# Altium project Field Sensor Front end.PrjPcb
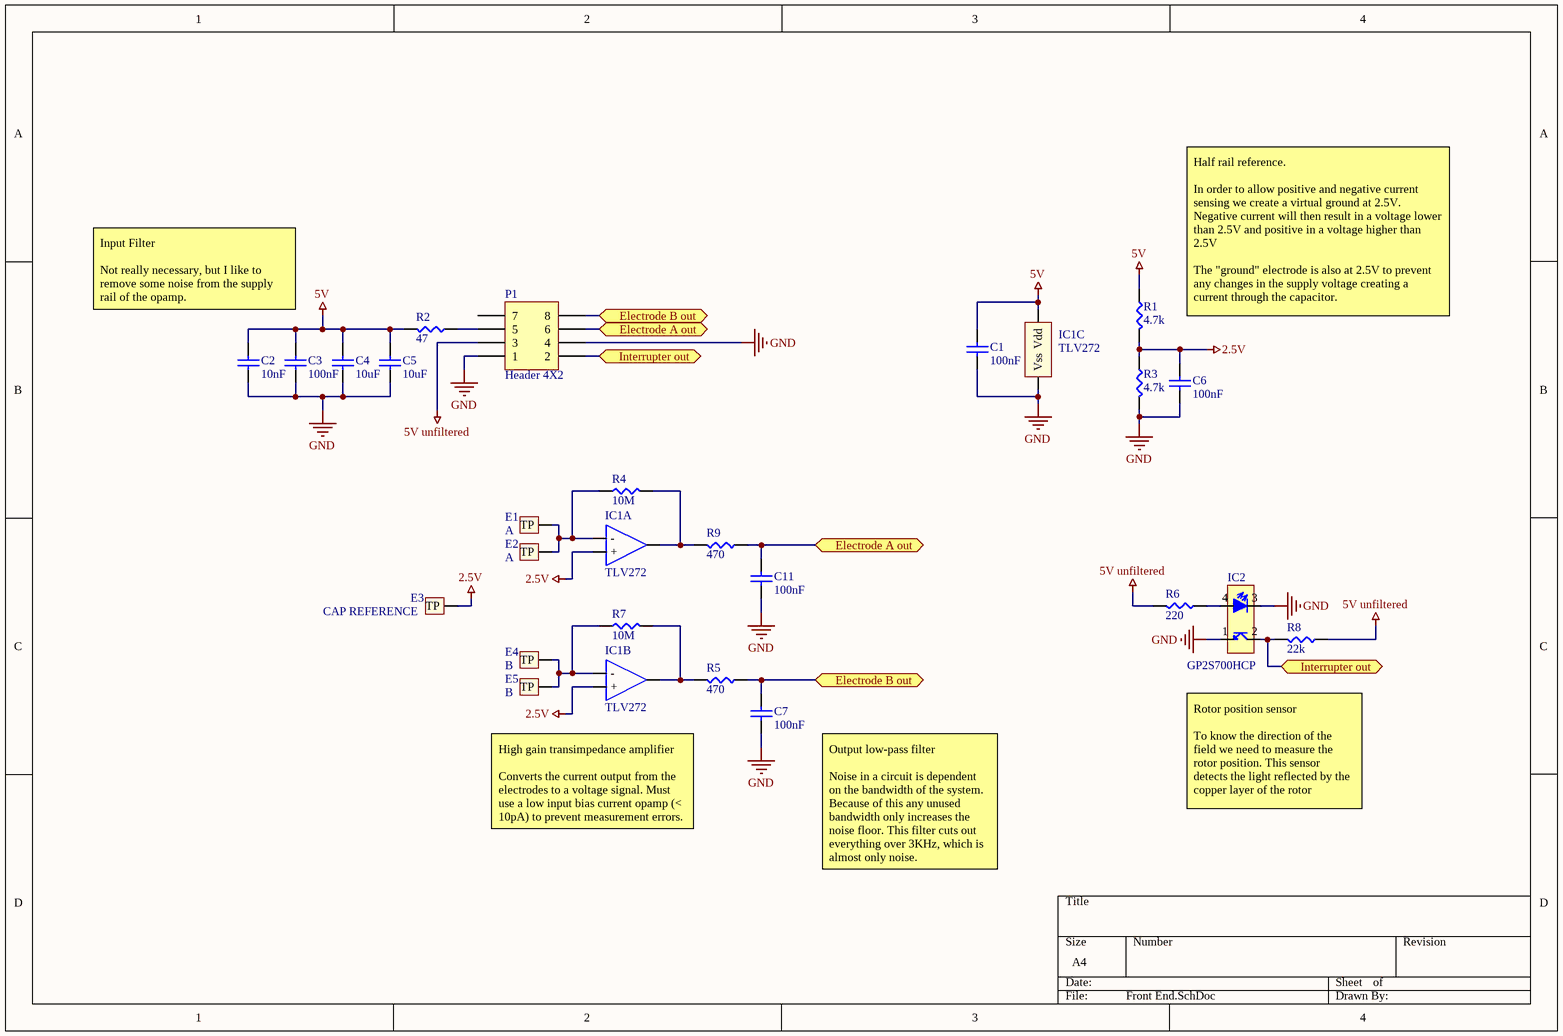
[diagram p0: Front End.SchDoc]
Author: Thorben Zethoff; Version: 0.1
1 sheet, 25 parts. Net scope: flat (ports and power ports of the same name join across sheets).
Board files: Rotor.PcbDoc, Stator.PcbDoc, Front End.PcbDoc

## Sheet Front End.SchDoc
size A4

### Parts
C1  100nF  [0805]
C2  10nF  [0805]
C3  100nF  [0805]
C4  10uF  [0805]
C5  10uF  [0805]
C6  100nF  [0805]
C7  100nF  [0805]
C11  100nF  [0805]
E1  A  [TESTPOINT_THT]
E2  A  [TESTPOINT_THT]
E3  CAP REFERENCE  [TESTPOINT_THT]
E4  B  [TESTPOINT_THT]
E5  B  [TESTPOINT_THT]
IC1  TLV272  [SO 8]  (parts A,B,C of 3)
IC2  GP2S700HCP  [GP2S700HCP]
P1  Header 4X2  [HDR2X4]
R1  4.7k  [0805]
R2  47  [0805]
R3  4.7k  [0805]
R4  10M  [0805]
R5  470  [0805]
R6  220  [0805]
R7  10M  [0805]
R8  22k  [0805]
R9  470  [0805]

### Ports
Electrode A out (bidir), Electrode B out (bidir), Interrupter out (bidir)

### Nets
2.5V: C6.2 E3.1(TP) IC1.IN1_+(+) IC1.IN2_+(+) R1.2 R3.1
5V: C1.2 C2.2 C3.2 C4.2 C5.2 IC1.Vdd R1.1 R2.2
5V unfiltered: P1.3 R6.2 R8.1
GND: C1.1 C2.1 C3.1 C4.1 C5.1 C6.1 C7.1 C11.1 IC1.Vss IC2.1 IC2.3 P1.1 P1.4 R3.2
NetC7_2: C7.2 P1.8 R5.1 ; port Electrode B out
NetC11_2: C11.2 P1.6 R9.1 ; port Electrode A out
NetE1_1: E1.1(TP) E2.1(TP) IC1.IN1-(-) R4.1
NetE4_1: E4.1(TP) E5.1(TP) IC1.IN2_-(-) R7.1
NetIC1_OUT1: IC1.OUT1(Out) R4.2 R9.2
NetIC1_OUT2: IC1.OUT2(Out) R5.2 R7.2
NetIC2_2: IC2.2 P1.2 R8.2 ; port Interrupter out
NetIC2_4: IC2.4 R6.1
NetP1_5: P1.5 R2.1

Not connected (* = marked no-connect by the designer): P1 7

### Notes on the sheet
- Input Filter
  Not really necessary, but I like to remove some noise from the supply rail of the opamp.
- Half rail reference.
  In order to allow positive and negative current sensing we create a virtual ground at 2.5V. Negative current will then result in a voltage lower than 2.5V and positive in a voltage higher than 2.5V
  The "ground" electrode is also at 2.5V to prevent any changes in the supply voltage creating a current through the capacitor.
- High gain transimpedance amplifier
  Converts the current output from the electrodes to a voltage signal. Must use a low input bias current opamp (< 10pA) to prevent measurement errors.
- Rotor position sensor
  To know the direction of the field we need to measure the rotor position. This sensor detects the light reflected by the copper layer of the rotor
- Output low-pass filter
  Noise in a circuit is dependent on the bandwidth of the system. Because of this any unused bandwidth only increases the noise floor. This filter cuts out everything over 3KHz, which is almost only noise.

### Library data of the parts
C1-C7 C11 = Cap: Supplier 1: Digi-Key; Supplier 2: Digi-Key; Supplier 3: Digi-Key; Supplier Part Number 1: 1276-2044-1-ND; Supplier Part Number 2: 1276-1018-1-ND; Supplier Part Number 3: 1276-1182-1-ND; Supplier 4: Digi-Key; Supplier 5: Digi-Key; Supplier 6: Digi-Key; Supplier 7: Digi-Key; Supplier 8: Digi-Key; Supplier 9: Digi-Key; Supplier Part Number 4: 1276-1009-1-ND; Supplier Part Number 5: 1276-1098-1-ND; Supplier Part Number 6: 1276-1119-1-ND; Supplier Part Number 7: 490-12737-1-ND; Supplier Part Number 9: 587-1249-1-ND; Supplier Part Number 8: 1276-1183-1-ND; Supplier 10: Digi-Key; Supplier 11: Digi-Key; Supplier 12: Digi-Key; Supplier 13: Digi-Key; Supplier Part Number 10: 1276-CL10B104KB8NNNLCT-ND; Supplier Part Number 11: 399-1085-1-ND; Supplier Part Number 13: 587-2985-1-ND; Supplier Part Number 12: 1276-1021-1-ND; Supplier 14: Digi-Key; Supplier 15: Digi-Key; Supplier 16: Digi-Key; Supplier 17: Digi-Key; Supplier 18: Digi-Key; Supplier 19: Digi-Key; Supplier Part Number 14: 490-14603-1-ND; Supplier Part Number 15: 311-3700-1-ND; Supplier Part Number 16: 311-1042-1-ND; Supplier Part Number 17: 311-1415-1-ND; Supplier Part Number 19: 587-4321-1-ND; Supplier Part Number 18: 1276-1907-1-ND; Supplier 20: Digi-Key; Supplier 21: Digi-Key; Supplier 22: Digi-Key; Supplier Part Number 20: 1276-6767-1-ND; Supplier Part Number 21: 1276-7060-1-ND; Supplier Part Number 22: 311-1084-1-ND
E1-E5 = Test Point
IC1 = OpAmp Dual: pin to pad: IN1 +>3 IN1->2 IN2 +>5 IN2 ->6 OUT1>1 OUT2>7 Vdd>8 Vss>4; Supplier 1: Digi-Key; Supplier Part Number 1: 497-TSZ182IDTCT-ND
IC2 = GP2S700HCP: Optical reflection interrupter; Supplier 1: Digi-Key; Supplier Part Number 1: 1855-1020-1-ND
P1 = Header 4X2: Header, 4-Pin, Dual row; LatestRevisionDate: 17-Jul-2002; LatestRevisionNote: Re-released for DXP Platform.; Publisher: Altium Limited
R1-R9 = Resistor: Supplier 1: Digi-Key; Supplier 2: Digi-Key; Supplier Part Number 1: RHM10DCT-ND; Supplier Part Number 2: 696-1834-1-ND; Supplier 3: Digi-Key; Supplier 4: Digi-Key; Supplier 5: Digi-Key; Supplier 6: Digi-Key; Supplier 7: Digi-Key; Supplier Part Number 3: RMCF0603JT3K90CT-ND; Supplier Part Number 5: RHM100DCT-ND; Supplier Part Number 6: RMCF0603FT54K9CT-ND; Supplier Part Number 7: RMCF0603FT40K2CT-ND; Supplier Part Number 4: RHM1.0KDCT-ND; Supplier 8: Digi-Key; Supplier 9: Digi-Key; Supplier 10: Digi-Key; Supplier 11: Digi-Key; Supplier Part Number 10: 311-200JRCT-ND; Supplier Part Number 11: 311-300JRCT-ND; Supplier Part Number 8: P200LCT-ND; Supplier Part Number 9: 311-1.0KJRCT-ND; Supplier 12: Digi-Key; Supplier 13: Digi-Key; Supplier 14: Digi-Key; Supplier 15: Digi-Key; Supplier 16: Digi-Key; Supplier 17: Digi-Key; Supplier Part Number 12: YAG3356CT-ND; Supplier Part Number 13: 311-220GRCT-ND; Supplier Part Number 14: 311-220KGRCT-ND; Supplier Part Number 15: 311-1.0KGRCT-ND; Supplier Part Number 16: 311-200KHRCT-ND; Supplier Part Number 17: A102451-ND; Supplier 18: Digi-Key; Supplier Part Number 18: 311-2.00KHRCT-ND; Supplier 19: Digi-Key; Supplier Part Number 19: 311-10KGRCT-ND; Supplier 20: Digi-Key; Supplier 21: Digi-Key; Supplier 22: Digi-Key; Supplier 23: Digi-Key; Supplier 24: Digi-Key; Supplier 25: Digi-Key; Supplier 26: Digi-Key; Supplier 27: Digi-Key; Supplier 28: Digi-Key; Supplier 29: Digi-Key; Supplier Part Number 29: 311-499KLRCT-ND; Supplier Part Number 28: 311-200KJRCT-ND; Supplier Part Number 26: YAG3226CT-ND; Supplier Part Number 20: 311-1.00LRCT-ND; Supplier Part Number 25: 311-12KJRCT-ND; Supplier Part Number 24: 311-10.0KLRCT-ND; Supplier Part Number 23: 311-4.7KJRCT-ND; Supplier Part Number 22: 311-2.2KJRCT-ND; Supplier Part Number 21: 311-220JRCT-ND; Supplier Part Number 27: 311-75KJRCT-ND; Supplier 30: Digi-Key; Supplier 31: Digi-Key; Supplier 32: Digi-Key; Supplier Part Number 32: 541-3127-6-ND; Supplier Part Number 31: 696-1677-1-ND; Supplier Part Number 30: YAG6087CT-ND; Supplier 33: Digi-Key; Supplier 34: Digi-Key; Supplier 35: Digi-Key; Supplier 36: Digi-Key; Supplier 37: Digi-Key; Supplier 38: Digi-Key; Supplier 39: Digi-Key; Supplier 40: Digi-Key; Supplier 41: Digi-Key; Supplier 42: Arrow; Supplier Part Number 33: 311-47.0HRCT-ND; Supplier Part Number 34: 311-470HRCT-ND; Supplier Part Number 37: 311-5.23KHRCT-ND; Supplier Part Number 36: 311-100KGRCT-ND; Supplier Part Number 35: 311-470KGRCT-ND; Supplier Part Number 38: 311-52.3KHRCT-ND; Supplier Part Number 39: 311-22KGRCT-ND; Supplier Part Number 41: 311-7.15KHRCT-ND; Supplier Part Number 42: RC0603FR-072K2L; Supplier Part Number 40: 311-15.8KHRCT-ND